# EAGLE design sprint_logger (EAGLE 7.2.0)
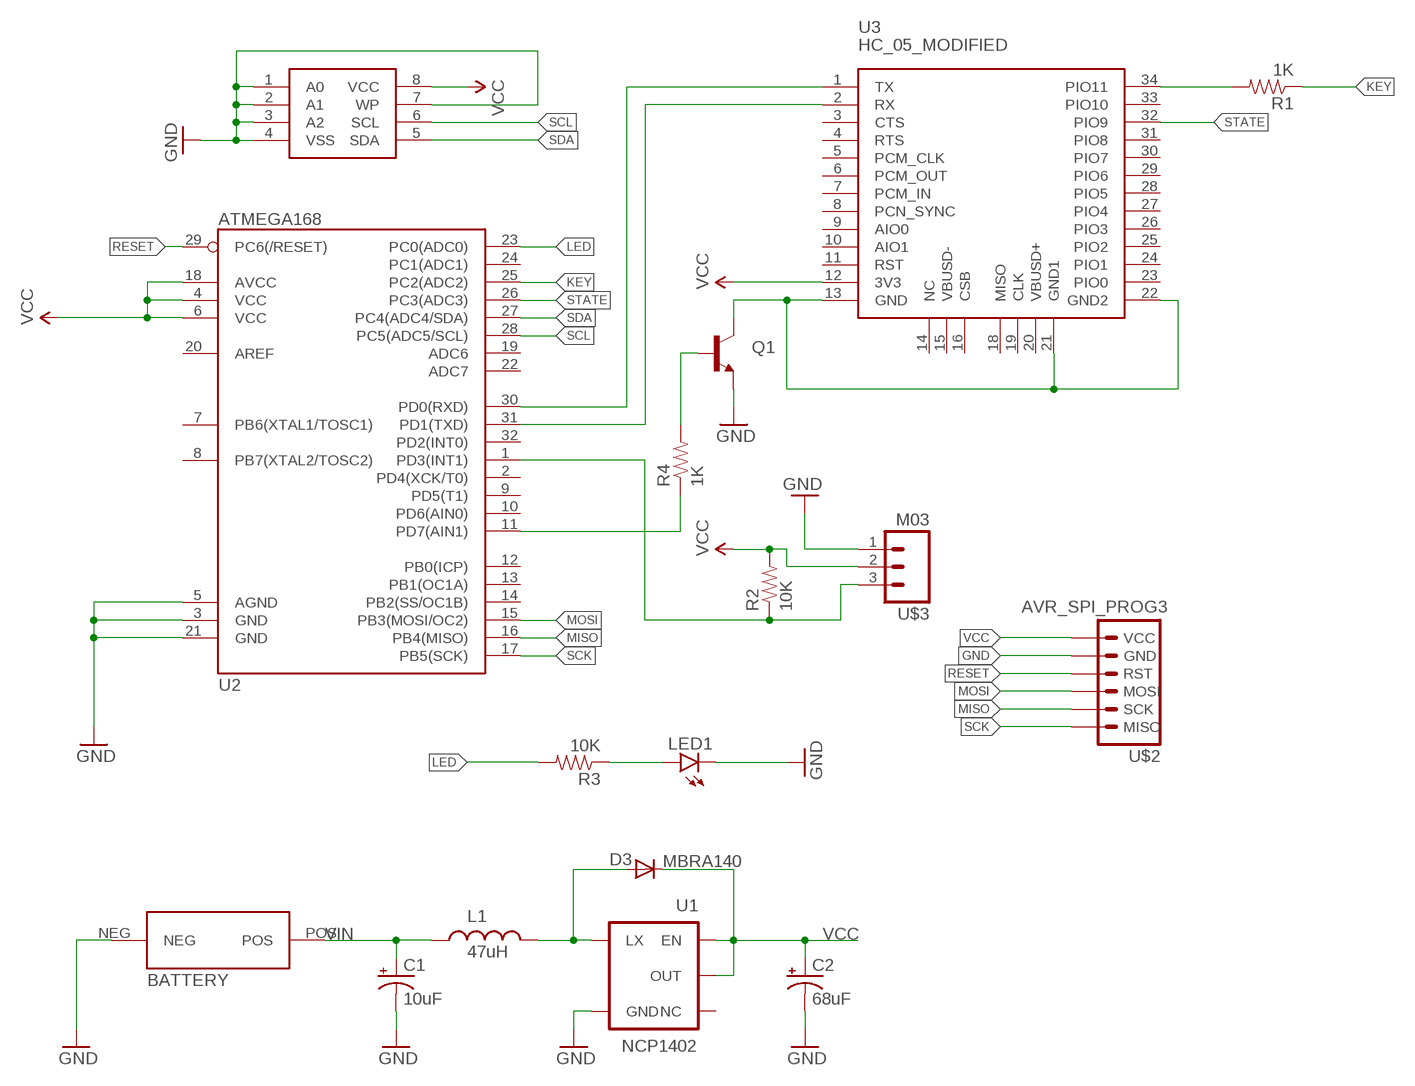
[diagram p0: schematic, sheet 1]

## Parts
BATTERY  BATHOLDER-N-2470  [BATHOLDER-N-2470]
C1  10uF  CAP_POL1206  [EIA3216]
C2  68uF  CAP_POL3528  [EIA3528]
D3  MBRA140  DIODESMA  [SMA-DIODE]
L1  47uH  INDUCTORCR54  [CR54]
LED1  LED1206  [LED-1206]
Q1  TRANSISTOR_NPNSOT23  [SOT23]
R1  1K  RESISTOR0805-RES  [0805]
R2  10K  RESISTOR0805-RES  [0805]
R3  10K  RESISTOR0805-RES  [0805]
R4  1K  RESISTOR0805-RES  [0805]
U1  NCP1402  V_REG_NCP1400SOT23-5  [SOT23-5]
U2  ATMEGA168  [TQFP32-08]
U3  HC_05_MODIFIED  [BLUETOOTH_SMD_MODIFIED]
U$1  24AAXXX  [SOIC-8-EIAJ]
U$2  AVR_SPI_PROG3  [1X06-SMD_EDGE]
U$3  M03  [1X06-SMD_EDGE]

## Nets
GND: BATTERY.NEG C1.C(-) C2.C(-) LED1.C Q1.2(E) U1.4(GND) U2.3(GND) U2.5(AGND) U2.21(GND) U$1.1(A0) U$1.2(A1) U$1.3(A2) U$1.4(VSS) U$1.7(WP) U$2.2(GND) U$3.1
KEY: R1.1 U2.25(PC2(ADC2))
LED: R3.2 U2.23(PC0(ADC0))
MISO: U2.16(PB4(MISO)) U$2.5(SCK)
MOSI: U2.15(PB3(MOSI/OC2)) U$2.4(MOSI)
N$1: R2.1 U2.1(PD3(INT1)) U$3.3
N$2: D3.A L1.P$2 U1.5(LX)
N$3: U2.30(PD0(RXD)) U3.1(TX)
N$4: U2.31(PD1(TXD)) U3.2(RX)
N$5: Q1.3(C) U3.13(GND) U3.21(GND1) U3.22(GND2)
N$6: LED1.A R3.1
N$8: Q1.1(B) R4.2
N$9: R4.1 U2.11(PD7(AIN1))
N$10: R1.2 U3.34(PIO11)
RESET: U2.29(PC6(/RESET)) U$2.3(RST)
SCK: U2.17(PB5(SCK)) U$2.6(MISO)
SCL: U2.28(PC5(ADC5/SCL)) U$1.6(SCL)
SDA: U2.27(PC4(ADC4/SDA)) U$1.5(SDA)
STATE: U2.26(PC3(ADC3)) U3.32(PIO9)
VCC: C2.A(+) D3.C R2.2 U1.1(EN) U1.2(OUT) U2.4(VCC) U2.6(VCC) U2.18(AVCC) U3.12(3V3) U$1.8(VCC) U$2.1(VCC) U$3.2
VIN: BATTERY.POS C1.A(+) L1.P$1
Unconnected: U1.3(NC) U2.2(PD4(XCK/T0)) U2.7(PB6(XTAL1/TOSC1)) U2.8(PB7(XTAL2/TOSC2)) U2.9(PD5(T1)) U2.10(PD6(AIN0)) U2.12(PB0(ICP)) U2.13(PB1(OC1A)) U2.14(PB2(SS/OC1B)) U2.19(ADC6) U2.20(AREF) U2.22(ADC7) U2.24(PC1(ADC1)) U2.32(PD2(INT0)) U3.3(CTS) U3.4(RTS) U3.5(PCM_CLK) U3.6(PCM_OUT) U3.7(PCM_IN) U3.8(PCN_SYNC) U3.9(AIO0) U3.10(AIO1) U3.11(RST) U3.14(NC) U3.15(VBUSD-) U3.16(CSB) U3.18(MISO) U3.19(CLK) U3.20(VBUSD+) U3.23(PIO0) U3.24(PIO1) U3.25(PIO2) U3.26(PIO3) U3.27(PIO4) U3.28(PIO5) U3.29(PIO6) U3.30(PIO7) U3.31(PIO8) U3.33(PIO10)

## Library data of the parts
BATTERY = petrocik:BATHOLDER-N-2470: Digi-Key Part Number KEY1123-ND
C1 C2 = SparkFun:CAP_POL: Capacitor Polarized These are standard SMD and PTH capacitors. Normally 10uF, 47uF, and 100uF in electrolytic and tantalum varieties. Always verify the external diameter of the through hole cap, it varies with capacity, voltage, and manufacturer. The EIA devices should be standard.
D3 = SparkFun:DIODE: Diode These are standard reverse protection diodes and small signal diodes. SMA package can handle up to about 1A. SOD-323 can handle about 200mA. What the SOD-323 package when ordering, there are some mfgs out there that are 5-pin packages.
L1 = SparkFun:INDUCTOR: Inductors Basic Inductor/Choke - 0603 and 1206. Footprints are not proven and vary greatly between part numbers.
LED1 = SparkFun-LED:LED: LEDs Standard schematic elements and footprints for 5mm, 3mm, 1206, and 0603 sized LEDs. 5mm - Spark Fun Electronics SKU : COM-00529 (and others)
Q1 = SparkFun-DiscreteSemi:TRANSISTOR_NPN: Generic NPN BJT. MMBT2222 is the common NPN we use. Double check against datasheet- not all devices are the same!
R1-R4 = SparkFun-Passives:RESISTOR: Resistor Basic schematic elements and footprints for 0603, 1206, and PTH resistors.
U1 = SparkFun:V_REG_NCP1400: Switching step-up voltage regulator NCP1400 switiching regulator takes single cell AA and outputs 100mA at 3.3V or 5V with minimal number of external components.
U2 = SparkFun-DigitalIC:ATMEGA168: Atmel 32-pin 8-bit micro, 16k flash.
U3 = ucigate:HC_05_MODIFIED: HC-05 Bluetooth Module, with pin 17 rmoved to allow trace on pcb board.
U$1 = ucigate:24AAXXX
U$2 = SparkFun-Connectors:AVR_SPI_PROG3: SMD edge programer
U$3 = petrocik:M03

## Board
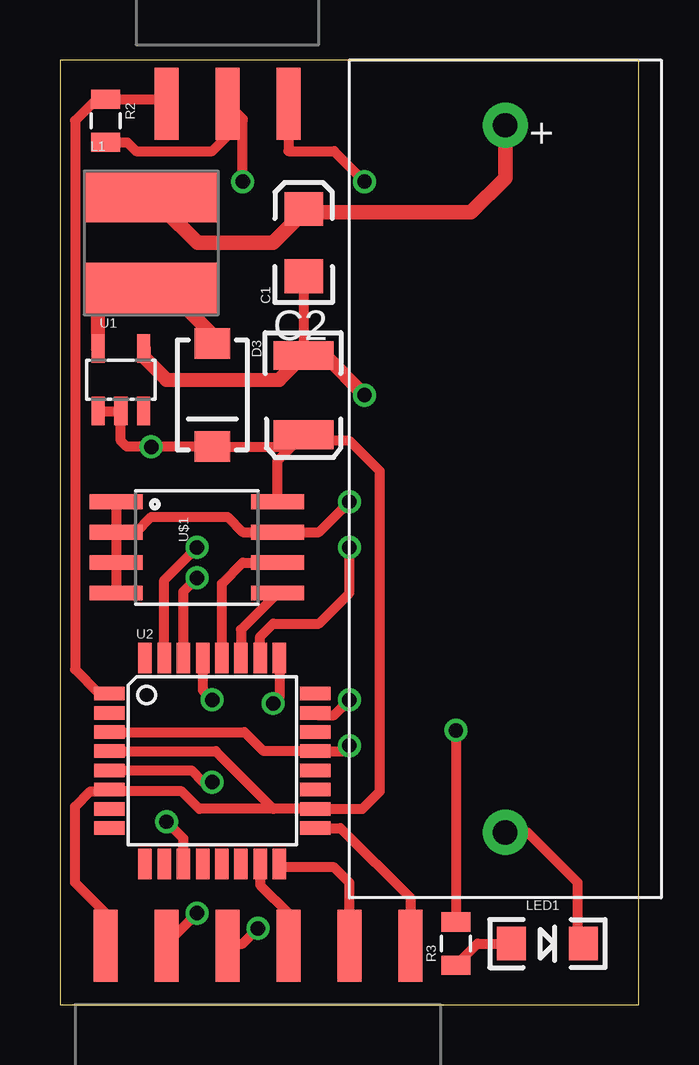
[diagram p1: board, top side]
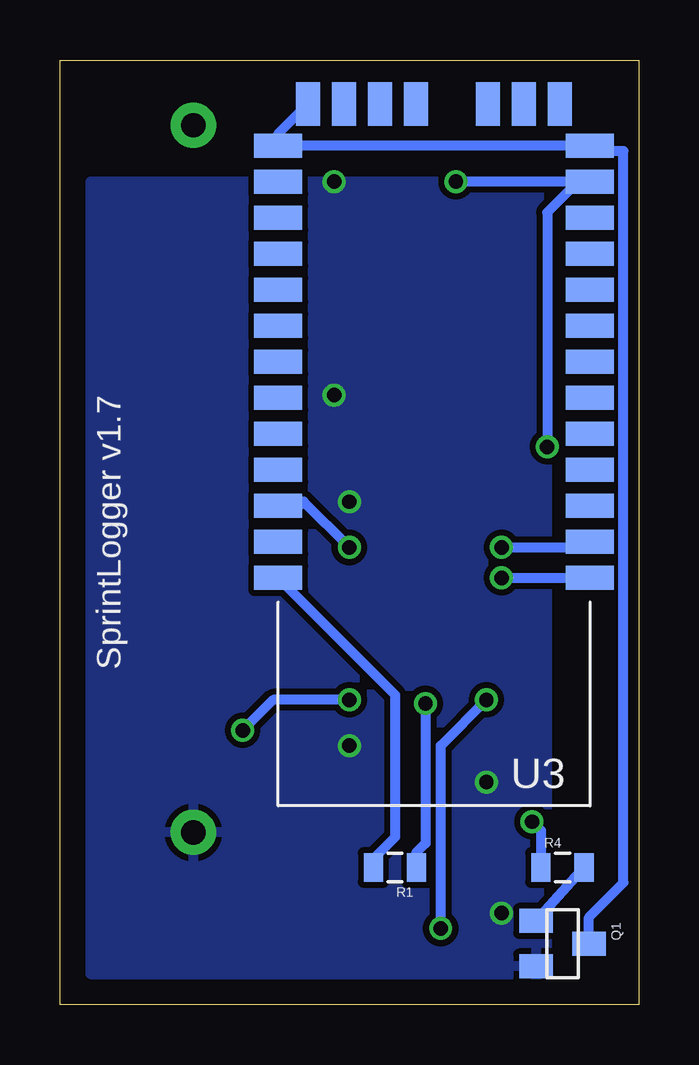
[diagram p2: board, bottom side, seen from below]

Size 24.13 x 39.36 mm. Coordinates in mm from the lower left corner, seen from the top.
Outline: 0,0 24.13,0 24.13,39.36 0,39.36 0,0
Copper layers (1*16): Top 0.0356mm / dielectric 1.5011mm / Bottom 0.0356mm
Design rules "LaenPCBOrder": minimum track width 6mil, minimum drill 13mil, track to track 6mil, track to pad 6mil, pad to pad 6mil, via to via 6mil, smd to smd 6mil, copper to edge 15mil, drill to drill 6mil, minimum pad ring 7mil, minimum via ring 7mil, stop-mask expansion 4mil, vias tented up to drill 0mil, thermal gap 10mil

### Footprints (pad centres in the part's own frame; a part is rotated, then mirrored left to right if it is on the bottom)
BATHOLDER-N-2470 = drill 1.016 pad 1.88: NEG 32.194,6.502; POS 2.731,6.502
EIA3216 = smd 1.4 x 1.6: A 1.4,0; C -1.4,0
EIA3528 = smd 1.2 x 2.5: A 1.65,0; C -1.65,0
SMA-DIODE = smd 1.27 x 1.47: A -2.15,0; C 2.15,0
CR54 = smd 5.5 x 2.15: P$1 0,1.92; P$2 0,-1.92
LED-1206 = smd 1.2 x 1.4: A -1.5,0; C 1.5,0
SOT23 = smd 1 x 1.4: 1 -0.95,-1.1; 2 0.95,-1.1; 3 0,1.1
0805 = smd 0.8 x 1.2: 1 -0.9,0; 2 0.9,0
SOT23-5 = smd 0.55 x 1.2: 1 -0.95,-1.3; 2 0,-1.3; 3 0.95,-1.3; 4 0.95,1.3; 5 -0.95,1.3
TQFP32-08 = smd 1.27 x 0.559: 1 -4.293,2.8; 2 -4.293,2; 3 -4.293,1.2; 4 -4.293,0.4; 5 -4.293,-0.4; 6 -4.293,-1.2; 7 -4.293,-2; 8 -4.293,-2.8; 17 4.293,-2.8; 18 4.293,-2; 19 4.293,-1.2; 20 4.293,-0.4; 21 4.293,0.4; 22 4.293,1.2; 23 4.293,2; 24 4.293,2.8 | smd 0.559 x 1.27: 9 -2.8,-4.293; 10 -2,-4.293; 11 -1.2,-4.293; 12 -0.4,-4.293; 13 0.4,-4.293; 14 1.2,-4.293; 15 2,-4.293; 16 2.8,-4.293; 25 2.8,4.293; 26 2,4.293; 27 1.2,4.293; 28 0.4,4.293; 29 -0.4,4.293; 30 -1.2,4.293; 31 -2,4.293; 32 -2.8,4.293
BLUETOOTH_SMD_MODIFIED = smd 2 x 1: 1 -6.35,3.81; 2 -6.35,2.31; 3 -6.35,0.81; 4 -6.35,-0.69; 5 -6.35,-2.19; 6 -6.35,-3.69; 7 -6.35,-5.19; 8 -6.35,-6.69; 9 -6.35,-8.19; 10 -6.35,-9.69; 11 -6.35,-11.19; 12 -6.35,-12.69; 13 -6.35,-14.19; 22 6.65,-14.19; 23 6.65,-12.69; 24 6.65,-11.19; 25 6.65,-9.69; 26 6.65,-8.19; 27 6.65,-6.69; 28 6.65,-5.19; 29 6.65,-3.69; 30 6.65,-2.19; 31 6.65,-0.69; 32 6.65,0.81; 33 6.65,2.31; 34 6.65,3.81 | smd 1 x 1.8: 14 -5.1,-15.94; 15 -3.6,-15.94; 16 -2.1,-15.94; 18 0.9,-15.94; 19 2.4,-15.94; 20 3.9,-15.94; 21 5.4,-15.94
SOIC-8-EIAJ = smd 0.61 x 2.21: 1 -1.905,-3.378; 2 -0.635,-3.378; 3 0.635,-3.378; 4 1.905,-3.378; 5 1.905,3.353; 6 0.635,3.353; 7 -0.635,3.353; 8 -1.905,3.353
1X06-SMD_EDGE = smd 1 x 3: 1 0,-0.08; 2 2.54,-0.08; 3 5.08,-0.08; 4 7.62,-0.08; 5 10.16,-0.08; 6 12.7,-0.08
1X06-SMD_EDGE' = smd 1 x 3: 1 0,-0.08; 2 2.54,-0.08; 3 5.08,-0.08

### Placement (x,y rotation side)
BATTERY  12.06,39.37 270 top
C1  10.16,31.75 90 top
C2  10.16,25.4 270 top
D3  6.35,25.4 270 top
L1  3.81,31.75 0 top
LED1  20.32,2.54 0 top
Q1  3.17,2.54 270 bottom
R1  10.16,5.71 180 bottom
R2  1.91,36.83 270 top
R3  16.51,2.54 90 top
R4  3.17,5.71 0 bottom
U1  2.54,26.04 0 top
U2  6.35,10.16 0 top
U3  8.38,21.59 180 bottom
U$1  5.71,19.05 270 top
U$2  1.91,2.54 0 top
U$3  M03  [1X06-SMD_EDGE']  9.53,37.47 180 top

### Tracks (layer width: path | path; a pad name or v marks a point on that pad's centre or on a via)
GND  (via drill 0.6)
  Top 0.406: U$1.1 U$1.2 | U$1.4 U$1.3 U$1.2 | U2.3 7.69,11.36 8.49,10.56 U2.21 11.83,10.56 v12.06,10.79 | U$1.2 3.17,19.68 3.81,20.32 6.99,20.32 7.62,19.68 U$1.7 10.79,19.68 v12.06,20.95 | 11.05,27.05 C2.C C1.C | U2.5 5.48,9.76 5.97,9.27 v6.35,9.27 | U$3.1 9.53,35.56 11.43,35.56 v12.7,34.29 | LED1.C 21.59,2.77 21.59,5.08 19.49,7.18 BATTERY.NEG | U$2.2 4.45,2.54 v5.71,3.81
  Top 0.584: 11.05,27.05 v12.7,25.4 | U1.4 3.49,26.99 4.45,26.04 9.14,26.04 C2.C
  pour Bottom (isolate 0.254): 3.81,34.29 22.86,34.29 22.86,1.27 3.81,1.27
KEY  (via drill 0.6)
  Top 0.406: U2.25 9.15,12.81 v8.89,12.55
  Bottom 0.406: v8.89,12.55 8.89,6.72 9.26,6.35 R1.1
LED  (via drill 0.6)
  Top 0.406: U2.23 10.74,12.06 11.43,12.06 v12.06,12.7 | v16.51,11.43 R3.2
  Bottom 0.406: v12.06,12.7 15.24,12.7 v16.51,11.43
MISO
  Top 0.406: U$2.5 12.06,5.08 11.43,5.71 9.3,5.71 U2.16
MOSI
  Top 0.406: U2.15 8.35,4.99 9.53,3.81 U$2.4
N$1
  Top 0.406: U2.1 1.65,12.96 0.64,13.97 0.64,36.83 1.53,37.73 R2.1 4.26,37.73 U$3.3
N$2
  Top 0.406: 6.35,30.48 5.08,30.48 | 5.08,30.48 4.46,30.48 L1.P$2 3.79,29.84 1.91,29.84 1.59,29.53 | 5.08,29.21 5.08,30.48
  Top 0.584: U1.5 1.59,29.53 | D3.A 6.35,27.94 5.08,29.21
N$3  (via drill 0.6)
  Top 0.406: U2.30 5.15,17.21 v5.71,17.78
  Bottom 0.406: v5.71,17.78 U3.1
N$4  (via drill 0.6)
  Top 0.406: U2.31 4.35,17.68 v5.71,19.05
  Bottom 0.406: v5.71,19.05 2.26,19.05 U3.2
N$5
  Bottom 0.406: U3.21 15.03,36.28 U3.22 U3.13 1.81,35.56 0.64,35.56 0.64,5.08 2.08,3.64 Q1.3
N$6
  Top 0.406: R3.1 17.41,2.54 LED1.A
N$8
  Bottom 0.406: R4.2 Q1.1
N$9  (via drill 0.6)
  Top 0.406: U2.11 5.15,6.92 v4.45,7.62
  Bottom 0.406: v4.45,7.62 4.08,7.25 R4.1
N$10
  Bottom 0.406: U3.34 10.16,12.91 10.16,6.99 11.06,6.08 R1.2
RESET  (via drill 0.6)
  Top 0.406: U$2.3 6.99,2.54 7.62,2.54 v8.26,3.17 | U2.29 5.95,13.1 v6.35,12.7
  Bottom 0.406: v6.35,12.7 8.26,10.79 v8.26,3.17
SCK
  Top 0.406: U2.17 11.69,7.36 14.61,4.45 U$2.6
SCL
  Top 0.406: U2.28 6.75,17.55 7.62,18.41 U$1.6
SDA
  Top 0.406: U$1.5 7.55,15.63 U2.27
STATE  (via drill 0.6)
  Top 0.406: U2.26 8.35,15.34 8.89,15.88 10.79,15.88 12.06,17.14 v12.06,19.05
  Bottom 0.406: 15.03,20.95 U3.32 14.14,20.78 13.97,20.95 v12.06,19.05
VCC  (via drill 0.6)
  Top 0.406: U1.1 U1.2 2.54,23.5 2.79,23.25 v3.8,23.25 v3.81,23.24 D3.C 9.66,23.25 C2.A | U$1.8 9.07,22.66 C2.A | 8.89,8.16 U2.18 12.61,8.16 13.34,8.89 13.34,22.23 12.06,23.5 10.41,23.5 C2.A | 8.89,8.16 5.81,8.16 5.08,8.89 2.13,8.89 U2.6 1.99,8.89 1.27,8.89 0.64,8.26 0.64,5.08 1.91,3.81 U$2.1 | U2.4 6.49,10.56 8.89,8.16 | v7.62,34.29 7.62,36.83 | 7.62,36.83 7.62,36.91 U$3.2 | R2.2 2.81,35.93 3.17,35.56 6.35,35.56 7.62,36.83
  Bottom 0.406: U3.12 2.54,34.28 | 2.54,34.28 v7.61,34.28 v7.62,34.29 | v3.81,23.24 3.81,33.01 2.54,34.28
VIN
  Top 0.406: 4.33,33.15 L1.P$1
  Top 0.61: 4.33,33.15 5.73,31.75 8.89,31.75 10.16,33.02 C1.A 10.29,33.02 17.14,33.02 18.57,34.44 BATTERY.POS

### Text on the board
bPlace: SprintLogger v1.7